# EAGLE schematic Resonator_ISTA (EAGLE 7.7.0)
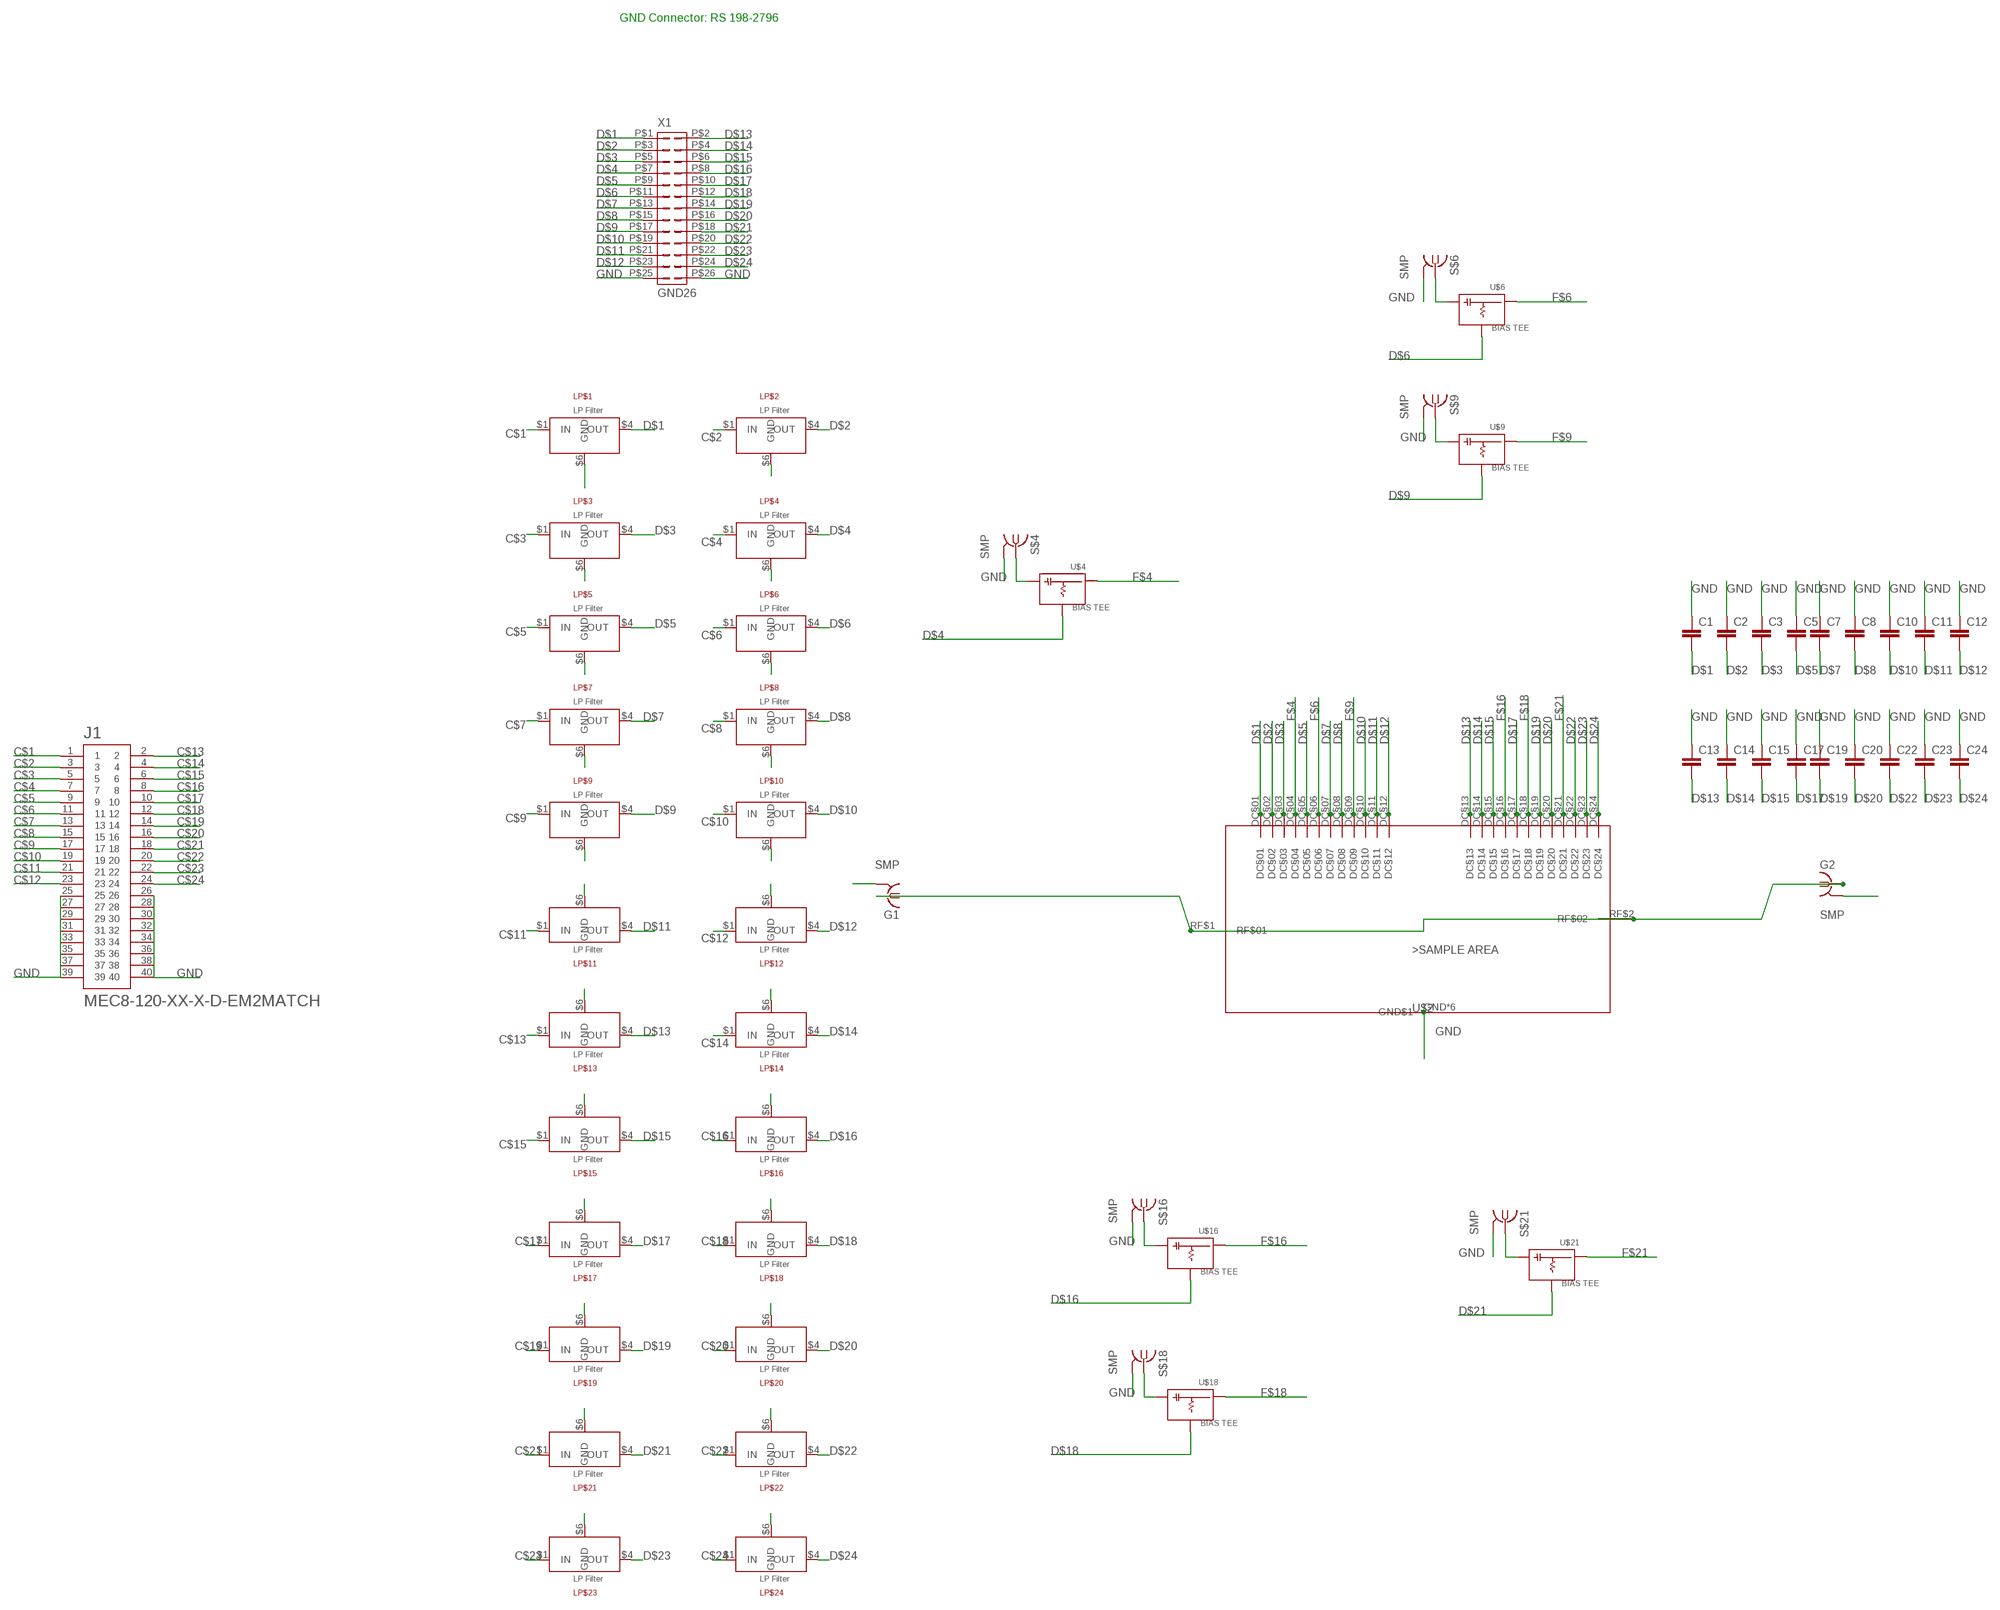
[diagram p0: schematic, sheet 1]

## Parts
C1  C-EUC0805K  [C0805K]
C2  C-EUC0805K  [C0805K]
C3  C-EUC0805K  [C0805K]
C5  C-EUC0805K  [C0805K]
C7  C-EUC0805K  [C0805K]
C8  C-EUC0805K  [C0805K]
C10  C-EUC0805K  [C0805K]
C11  C-EUC0805K  [C0805K]
C12  C-EUC0805K  [C0805K]
C13  C-EUC0805K  [C0805K]
C14  C-EUC0805K  [C0805K]
C15  C-EUC0805K  [C0805K]
C17  C-EUC0805K  [C0805K]
C19  C-EUC0805K  [C0805K]
C20  C-EUC0805K  [C0805K]
C22  C-EUC0805K  [C0805K]
C23  C-EUC0805K  [C0805K]
C24  C-EUC0805K  [C0805K]
G1  MC-921  [SMP_STRAIGHT_MINI_WIDE_V1_01_ROUND]
G2  MC-921  [SMP_STRAIGHT_MINI_WIDE_V1_01_ROUND]
J1  MEC8-120-XX-X-D-EM2MATCH  [SAMTEC_MEC8-120-XX-X-D-EM2_MATCH]
LP$1  LP-FILTER/1-STAGETOP  [LP-FILTER/1_STAGE/OS/0603_TOP]
LP$2  LP-FILTER/1-STAGETOP  [LP-FILTER/1_STAGE/OS/0603_TOP]
LP$3  LP-FILTER/1-STAGEBOT  [LP-FILTER/1_STAGE/OS/0603_BOTTOM]
LP$4  LP-FILTER/1-STAGEBOT  [LP-FILTER/1_STAGE/OS/0603_BOTTOM]
LP$5  LP-FILTER/1-STAGEBOT  [LP-FILTER/1_STAGE/OS/0603_BOTTOM]
LP$6  LP-FILTER/1-STAGEBOT  [LP-FILTER/1_STAGE/OS/0603_BOTTOM]
LP$7  LP-FILTER/1-STAGEBOT  [LP-FILTER/1_STAGE/OS/0603_BOTTOM]
LP$8  LP-FILTER/1-STAGEBOT  [LP-FILTER/1_STAGE/OS/0603_BOTTOM]
LP$9  LP-FILTER/1-STAGETOP  [LP-FILTER/1_STAGE/OS/0603_TOP]
LP$10  LP-FILTER/1-STAGETOP  [LP-FILTER/1_STAGE/OS/0603_TOP]
LP$11  LP-FILTER/1-STAGETOP  [LP-FILTER/1_STAGE/OS/0603_TOP]
LP$12  LP-FILTER/1-STAGETOP  [LP-FILTER/1_STAGE/OS/0603_TOP]
LP$13  LP-FILTER/1-STAGETOP  [LP-FILTER/1_STAGE/OS/0603_TOP]
LP$14  LP-FILTER/1-STAGETOP  [LP-FILTER/1_STAGE/OS/0603_TOP]
LP$15  LP-FILTER/1-STAGETOP  [LP-FILTER/1_STAGE/OS/0603_TOP]
LP$16  LP-FILTER/1-STAGETOP  [LP-FILTER/1_STAGE/OS/0603_TOP]
LP$17  LP-FILTER/1-STAGETOP  [LP-FILTER/1_STAGE/OS/0603_TOP]
LP$18  LP-FILTER/1-STAGETOP  [LP-FILTER/1_STAGE/OS/0603_TOP]
LP$19  LP-FILTER/1-STAGETOP  [LP-FILTER/1_STAGE/OS/0603_TOP]
LP$20  LP-FILTER/1-STAGETOP  [LP-FILTER/1_STAGE/OS/0603_TOP]
LP$21  LP-FILTER/1-STAGETOP  [LP-FILTER/1_STAGE/OS/0603_TOP]
LP$22  LP-FILTER/1-STAGETOP  [LP-FILTER/1_STAGE/OS/0603_TOP]
LP$23  LP-FILTER/1-STAGETOP  [LP-FILTER/1_STAGE/OS/0603_TOP]
LP$24  LP-FILTER/1-STAGETOP  [LP-FILTER/1_STAGE/OS/0603_TOP]
S$4  MC-921  [SMP_STRAIGHT_MINI_WIDE_V1_01_ROUND]
S$6  MC-921  [SMP_STRAIGHT_MINI_WIDE_V1_01_ROUND]
S$9  MC-921  [SMP_STRAIGHT_MINI_WIDE_V1_01_ROUND]
S$16  MC-921  [SMP_STRAIGHT_MINI_WIDE_V1_01_ROUND]
S$18  MC-921  [SMP_STRAIGHT_MINI_WIDE_V1_01_ROUND]
S$21  MC-921  [SMP_STRAIGHT_MINI_WIDE_V1_01_ROUND]
U$2  24DC+4FAST+2RF_NO_HOLETEST  [24DC+4FASTGATE+2RF/6.0X6.0_V2.11]
U$4  BIASTEETHINUP  [BIAS_TEE_UP_0603_THIN]
U$6  BIASTEETHIN  [BIAS_TEE_DOWN_0603_THIN]
U$9  BIASTEETHIN  [BIAS_TEE_DOWN_0603_THIN]
U$16  BIASTEETHINUP  [BIAS_TEE_UP_0603_THIN]
U$18  BIASTEETHINUP  [BIAS_TEE_UP_0603_THIN]
U$21  BIASTEETHIN  [BIAS_TEE_DOWN_0603_THIN]
X1  GND26  [SMD2X13]

## Nets
C$1: J1.1 LP$1.$1(IN)
C$2: J1.3 LP$2.$1(IN)
C$3: J1.5 LP$3.$1(IN)
C$4: J1.7 LP$4.$1(IN)
C$5: J1.9 LP$5.$1(IN)
C$6: J1.11 LP$6.$1(IN)
C$7: J1.13 LP$7.$1(IN)
C$8: J1.15 LP$8.$1(IN)
C$9: J1.17 LP$9.$1(IN)
C$10: J1.19 LP$10.$1(IN)
C$11: J1.21 LP$11.$1(IN)
C$12: J1.23 LP$12.$1(IN)
C$13: J1.2 LP$13.$1(IN)
C$14: J1.4 LP$14.$1(IN)
C$15: J1.6 LP$15.$1(IN)
C$16: J1.8 LP$16.$1(IN)
C$17: J1.10 LP$17.$1(IN)
C$18: J1.12 LP$18.$1(IN)
C$19: J1.14 LP$19.$1(IN)
C$20: J1.16 LP$20.$1(IN)
C$21: J1.18 LP$21.$1(IN)
C$22: J1.20 LP$22.$1(IN)
C$23: J1.22 LP$23.$1(IN)
C$24: J1.24 LP$24.$1(IN)
D$1: C1.2 LP$1.$4(OUT) U$2.DC§01 X1.P$1
D$2: C2.2 LP$2.$4(OUT) U$2.DC§02 X1.P$3
D$3: C3.2 LP$3.$4(OUT) U$2.DC§03 X1.P$5
D$4: LP$4.$4(OUT) U$4.LF X1.P$7
D$5: C5.2 LP$5.$4(OUT) U$2.DC§05 X1.P$9
D$6: LP$6.$4(OUT) U$6.LF X1.P$11
D$7: C7.2 LP$7.$4(OUT) U$2.DC§07 X1.P$13
D$8: C8.2 LP$8.$4(OUT) U$2.DC§08 X1.P$15
D$9: LP$9.$4(OUT) U$9.LF X1.P$17
D$10: C10.2 LP$10.$4(OUT) U$2.DC§10 X1.P$19
D$11: C11.2 LP$11.$4(OUT) U$2.DC§11 X1.P$21
D$12: C12.2 LP$12.$4(OUT) U$2.DC§12 X1.P$23
D$13: C13.2 LP$13.$4(OUT) U$2.DC§13 X1.P$2
D$14: C14.2 LP$14.$4(OUT) U$2.DC§14 X1.P$4
D$15: C15.2 LP$15.$4(OUT) U$2.DC§15 X1.P$6
D$16: LP$16.$4(OUT) U$16.LF X1.P$8
D$17: C17.2 LP$17.$4(OUT) U$2.DC§17 X1.P$10
D$18: LP$18.$4(OUT) U$18.LF X1.P$12
D$19: C19.2 LP$19.$4(OUT) U$2.DC§19 X1.P$14
D$20: C20.2 LP$20.$4(OUT) U$2.DC§20 X1.P$16
D$21: LP$21.$4(OUT) U$21.LF X1.P$18
D$22: C22.2 LP$22.$4(OUT) U$2.DC§22 X1.P$20
D$23: C23.2 LP$23.$4(OUT) U$2.DC§23 X1.P$22
D$24: C24.2 LP$24.$4(OUT) U$2.DC§24 X1.P$24
F$4 [RF]: U$2.DC§04 U$4.OUT
F$6 [RF]: U$2.DC§06 U$6.OUT
F$9 [RF]: U$2.DC§09 U$9.OUT
F$16 [RF]: U$2.DC§16 U$16.OUT
F$18 [RF]: U$2.DC§18 U$18.OUT
F$21 [RF]: U$2.DC§21 U$21.OUT
GND: C1.1 C2.1 C3.1 C5.1 C7.1 C8.1 C10.1 C11.1 C12.1 C13.1 C14.1 C15.1 C17.1 C19.1 C20.1 C22.1 C23.1 C24.1 G1.GND G1.GND@1(GND) G2.GND G2.GND@1(GND) J1.25 J1.26 J1.27 J1.28 J1.29 J1.30 J1.31 J1.32 J1.33 J1.34 J1.35 J1.36 J1.37 J1.38 J1.39 J1.40 LP$1.$6(GND) LP$2.$6(GND) LP$3.$6(GND) LP$4.$6(GND) LP$5.$6(GND) LP$6.$6(GND) LP$7.$6(GND) LP$8.$6(GND) LP$9.$6(GND) LP$10.$6(GND) LP$11.$6(GND) LP$12.$6(GND) LP$13.$6(GND) LP$14.$6(GND) LP$15.$6(GND) LP$16.$6(GND) LP$17.$6(GND) LP$18.$6(GND) LP$19.$6(GND) LP$20.$6(GND) LP$21.$6(GND) LP$22.$6(GND) LP$23.$6(GND) LP$24.$6(GND) S$4.GND S$4.GND@1(GND) S$6.GND S$6.GND@1(GND) S$9.GND S$9.GND@1(GND) S$16.GND S$16.GND@1(GND) S$18.GND S$18.GND@1(GND) S$21.GND S$21.GND@1(GND) U$2.GND1(GND$1) U$2.GND2(GND$1) U$2.GND3(GND$1) U$2.GND4(GND$1) U$2.GND5(GND$1) U$2.GND(GND$1) X1.P$25 X1.P$26
N$1 [RF]: S$16.1 U$16.HF
N$2 [RF]: S$21.1 U$21.HF
N$4 [RF]: S$4.1 U$4.HF
N$5 [RF]: S$9.1 U$9.HF
N$6 [RF]: G1.1 G2.1 U$2.RF$1(RF$01) U$2.RF$2(RF$02)
N$7 [RF]: S$6.1 U$6.HF
N$8 [RF]: S$18.1 U$18.HF

## Notes on the sheet
- GND Connector: RS 198-2796

## Library data of the parts
C1-C3 C5 C7 C8 C10-C15 C17 C19 C20 C22-C24 = rcl:C-EU: CAPACITOR, European symbol
G1 G2 S$4 S$6 S$9 S$16 S$18 S$21 = RF Connectors:MC-921: COAX. MICROWAVE CONNECTOR O/D diam 2.1 Source: www.tycoelectronics.com .. Electronics .. ENG_CD_1775146_A2.pdf
J1 = MEC8-120-XX-X-D-EM2:MEC8-120-XX-X-D-EM2: 0.8mm DUAL EDGE MOUNT MINI-EDGE CARD ASSEMBLY
LP$1-LP$24 = LPFilter:LP-FILTER/1-STAGE
U$2 = SampleArea_new2:24DC+4FAST+2RF_NO_HOLE
U$4 U$6 U$9 U$16 U$18 U$21 = Bias tee:BIASTEE
X1 = GND_Connector:GND26: 50 Pin - 2mm Dual Row Single Wafer, Vertical T/H HDR Source: http://www.molex.com/pdm_docs/sd/877580616_sd.pdf

## Net classes
0 GND: clearance 0.15 mm
1 RF: width 0.6 mm, clearance 0.75 mm
2 RF2: width 0.6 mm, clearance 0.75 mm